# EAGLE design 04_ControllerStage_v1 (EAGLE 9.6.2)

## Sheet 1 of 2
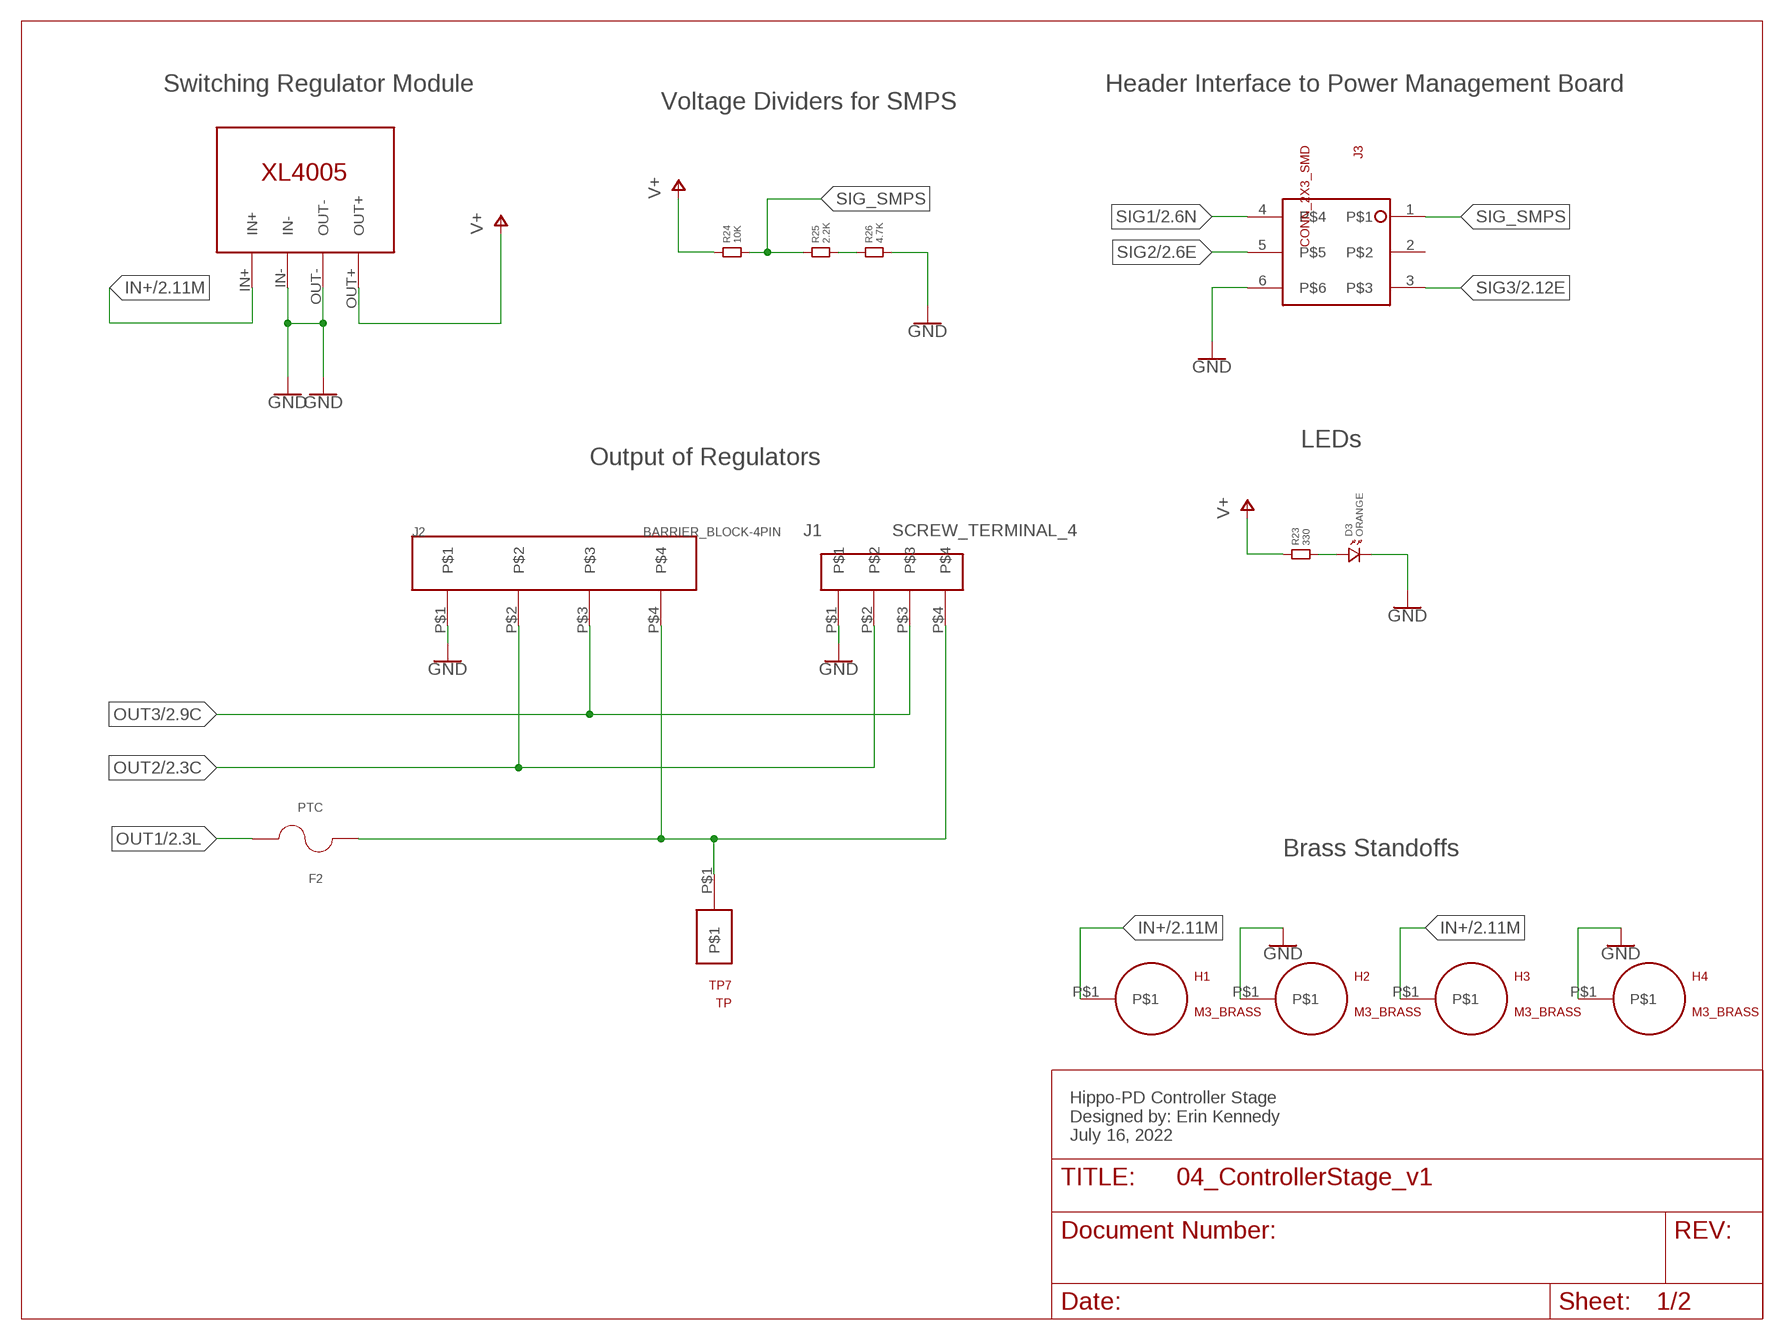
[diagram p0: schematic, sheet 1]

### Parts
D3  ORANGE  LED.1206  [1206.LED]
F2  PTC  [PTC]
H1  M3_BRASS  [M3_BRASS]
H2  M3_BRASS  [M3_BRASS]
H3  M3_BRASS  [M3_BRASS]
H4  M3_BRASS  [M3_BRASS]
J1  SCREW_TERMINAL_4  [SCREW_TERM_4]
J2  BARRIER_BLOCK-4PIN  [BARRIERBLOCK-4PIN]
J3  CONN_2X3_SMD  [2X3_SMD_CONNECTOR]
R23  330  RESISTOR.1206  [1206]
R24  10K  RESISTOR.1206  [1206]
R25  2.2K  RESISTOR.1206  [1206]
R26  4.7K  RESISTOR.1206  [1206]
TP7  TP  [TP]
U1  XL4005-DEV  [XL4005-DEV]

### Nets
GND: D3.P$2 H2.P$1 H4.P$1 J1.P$1 J2.P$1 J3.6 R26.2 U1.IN- U1.OUT- ; also sheet 2
IN+: H1.P$1 H3.P$1 U1.IN+ ; also sheet 2
N$7: D3.P$1 R23.2
N$9: R25.2 R26.1
N$18: F2.1 J1.P$4 J2.P$4 TP7.P$1
OUT1: F2.2 ; also sheet 2
OUT2: J1.P$2 J2.P$2 ; also sheet 2
OUT3: J1.P$3 J2.P$3 ; also sheet 2
SIG1: J3.4 ; also sheet 2
SIG2: J3.5 ; also sheet 2
SIG3: J3.3 ; also sheet 2
SIG_SMPS: J3.1 R24.2 R25.1
V+: R23.1 R24.1 U1.OUT+ ; also sheet 2
Unconnected: J3.2

### Notes on the sheet
- Switching Regulator Module | Header Interface to Power Management Board
- Voltage Dividers for SMPS
- LEDs
- Output of Regulators
- Brass Standoffs
- Hippo-PD Controller Stage
  Designed by: Erin Kennedy
  July 16, 2022

## Sheet 2 of 2
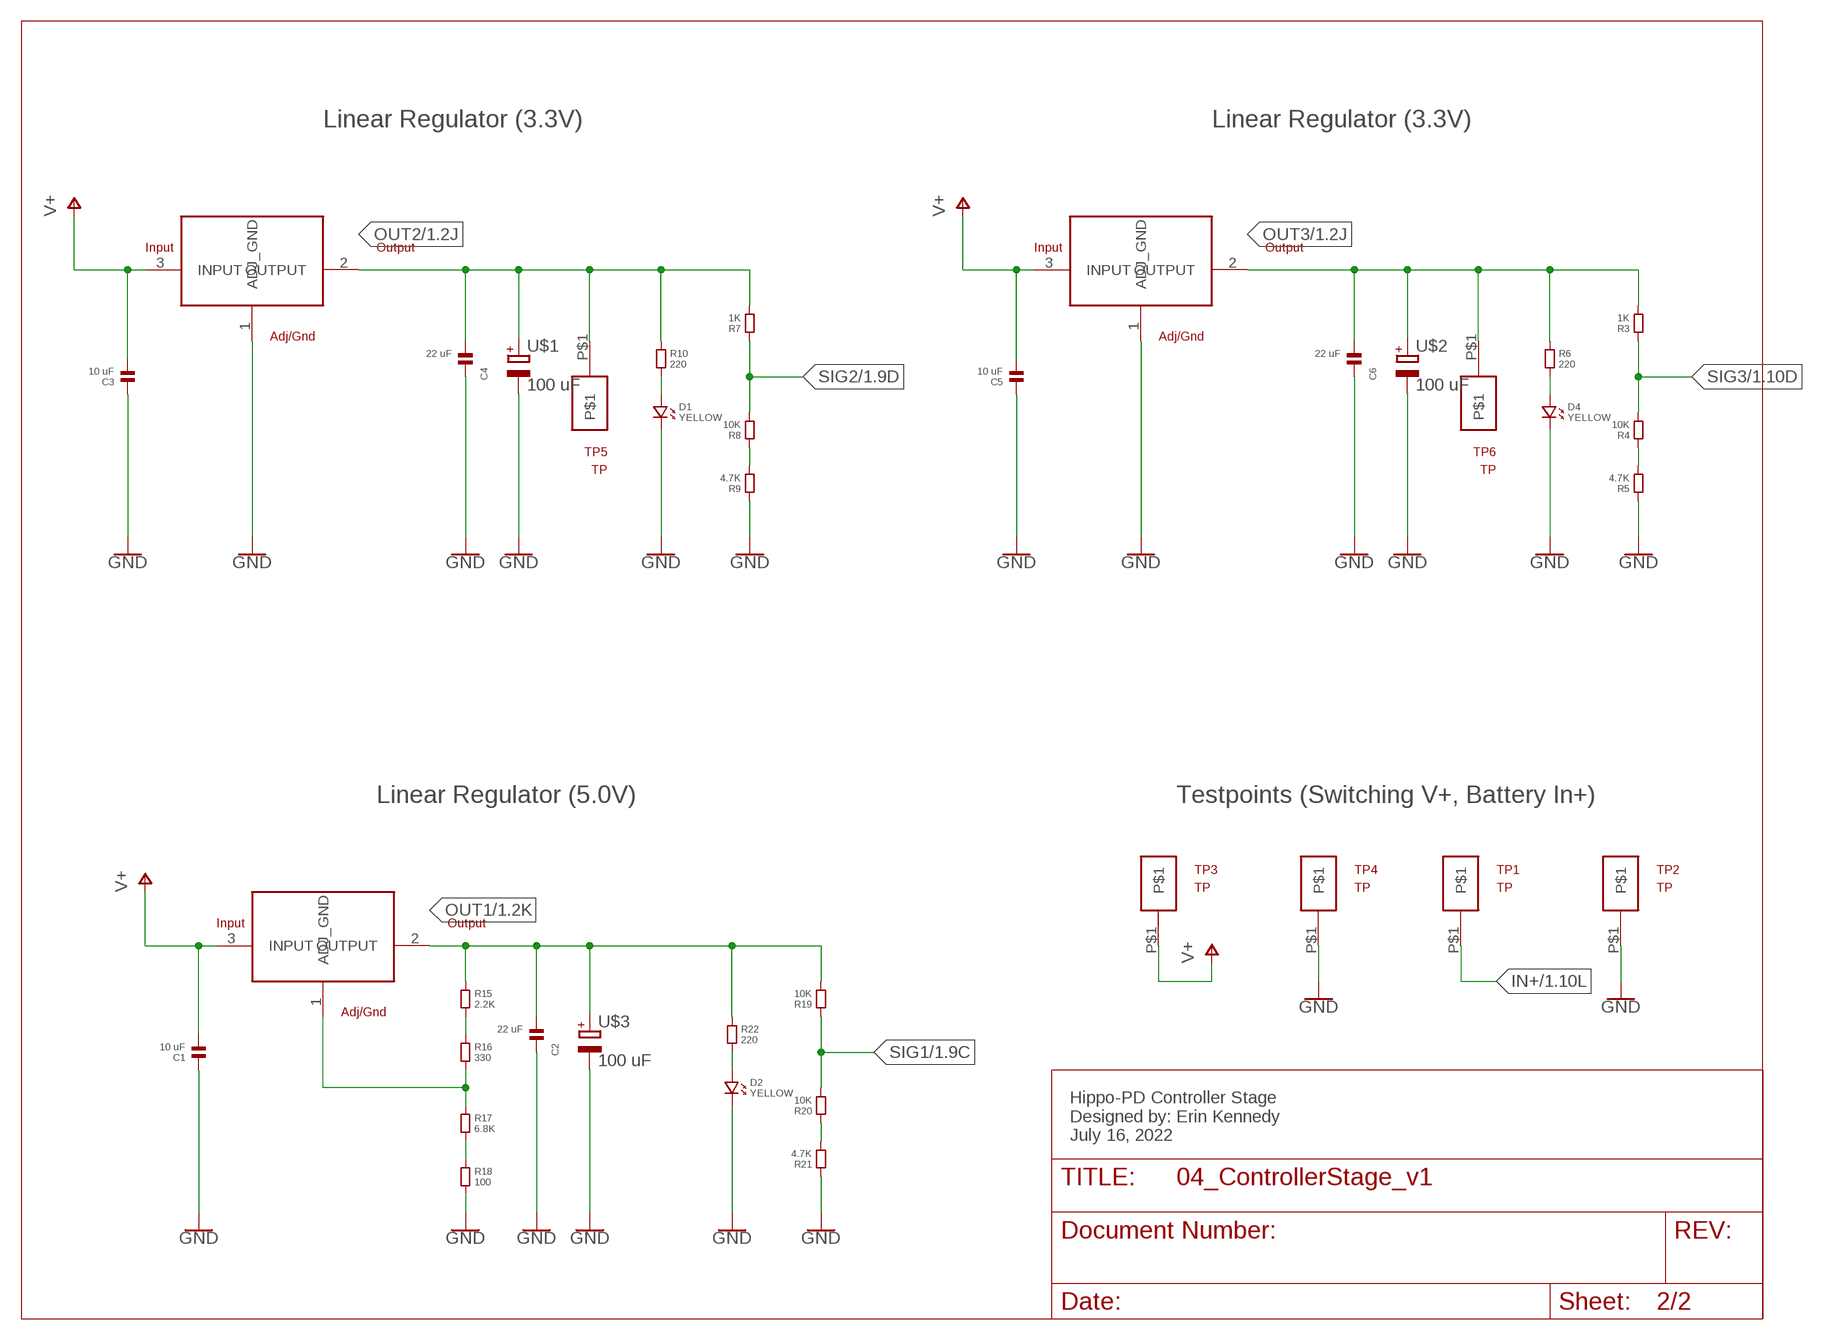
[diagram p1: schematic, sheet 2]

### Parts
C1  10 uF  CAPACITOR.1206  [1206]
C2  22 uF  CAPACITOR.1206  [1206]
C3  10 uF  CAPACITOR.1206  [1206]
C4  22 uF  CAPACITOR.1206  [1206]
C5  10 uF  CAPACITOR.1206  [1206]
C6  22 uF  CAPACITOR.1206  [1206]
D1  YELLOW  LED.1206  [1206.LED]
D2  YELLOW  LED.1206  [1206.LED]
D4  YELLOW  LED.1206  [1206.LED]
R1  AZ1117CDAZ1117CD  [AZ1117CD]
R2  AZ1117CDAZ1117CD  [AZ1117CD]
R3  1K  RESISTOR.1206  [1206]
R4  10K  RESISTOR.1206  [1206]
R5  4.7K  RESISTOR.1206  [1206]
R6  220  RESISTOR.1206  [1206]
R7  1K  RESISTOR.1206  [1206]
R8  10K  RESISTOR.1206  [1206]
R9  4.7K  RESISTOR.1206  [1206]
R10  220  RESISTOR.1206  [1206]
R14  AZ1084C  [AZ1084C]
R15  2.2K  RESISTOR.1206  [1206]
R16  330  RESISTOR.1206  [1206]
R17  6.8K  RESISTOR.1206  [1206]
R18  100  RESISTOR.1206  [1206]
R19  10K  RESISTOR.1206  [1206]
R20  10K  RESISTOR.1206  [1206]
R21  4.7K  RESISTOR.1206  [1206]
R22  220  RESISTOR.1206  [1206]
TP1  TP  [TP]
TP2  TP  [TP]
TP3  TP  [TP]
TP4  TP  [TP]
TP5  TP  [TP]
TP6  TP  [TP]
U$1  100 uF  ELECTROLYTIC_CAP  [ELECTROLYTIC_CAP]
U$2  100 uF  ELECTROLYTIC_CAP  [ELECTROLYTIC_CAP]
U$3  100 uF  ELECTROLYTIC_CAP  [ELECTROLYTIC_CAP]

### Nets
GND: C1.1 C2.1 C3.1 C4.1 C5.1 C6.1 D1.P$2 D2.P$2 D4.P$2 R1.1(ADJ_GND) R2.1(ADJ_GND) R5.1 R9.1 R18.2 R21.1 TP2.P$1 TP4.P$1 U$1.- U$2.- U$3.- ; also sheet 1
IN+: TP1.P$1 ; also sheet 1
N$1: D1.P$1 R10.2
N$2: D4.P$1 R6.2
N$3: R4.1 R5.2
N$5: R8.1 R9.2
N$10: D2.P$1 R22.2
N$11: R15.2 R16.1
N$12: R14.1(ADJ_GND) R16.2 R17.1
N$13: R17.2 R18.1
N$14: R20.1 R21.2
OUT1: C2.2 R14.2(OUTPUT) R15.1 R19.2 R22.1 U$3.+ ; also sheet 1
OUT2: C4.2 R1.2(OUTPUT) R7.2 R10.1 TP5.P$1 U$1.+ ; also sheet 1
OUT3: C6.2 R2.2(OUTPUT) R3.2 R6.1 TP6.P$1 U$2.+ ; also sheet 1
SIG1: R19.1 R20.2 ; also sheet 1
SIG2: R7.1 R8.2 ; also sheet 1
SIG3: R3.1 R4.2 ; also sheet 1
V+: C1.2 C3.2 C5.2 R1.3(INPUT) R2.3(INPUT) R14.3(INPUT) TP3.P$1 ; also sheet 1

### Notes on the sheet
- Linear Regulator (3.3V) | Linear Regulator (3.3V)
- Linear Regulator (5.0V) | Testpoints (Switching V+, Battery In+)
- Hippo-PD Controller Stage
  Designed by: Erin Kennedy
  July 16, 2022

## Library data of the parts
C1-C6 = standardparts:CAPACITOR
D1-D4 = standardparts:LED
F2 = Hippo-PS:PTC: PTC Resettable Fuse 0.75A(hold) 1.5A(trip) 60VDC 40A 1.5W 0.3s 0.18Ohm SMD Solder Pad 7.98 X 5.44 X 1.15mm T/R Check availability <https://pricing.snapeda.com/parts/0ZCF0075AF2C/Bel%20Fuse/view-part?ref=eda>; AVAILABILITY: In Stock; DESCRIPTION: 2920 SMT PPTC | 0.75 Ih | 603V; MF: Bel Fuse; MP: 0ZCF0075AF2C; PACKAGE: 2920 Bel Fuse; PRICE: None; PURCHASE-URL: https://pricing.snapeda.com/search/part/0ZCF0075AF2C/?ref=eda
H1-H4 = Hippo-PS:M3_BRASS
J1 = EK's Parts:SCREW_TERMINAL_4
J2 = Hippo-PS:BARRIER_BLOCK-4PIN: Barrier block connector Digikey #ED2946-ND
J3 = Hippo-PS:CONN_2X3_SMD
R1 R2 = Hippo-PS:AZ1117CD
R3-R10 R15-R26 = standardparts:RESISTOR
R14 = Hippo-PS:AZ1084C
TP1-TP7 = Hippo-PS:TP
U1 = Hippo-PS:XL4005-DEV
U$1-U$3 = Hippo-PS:ELECTROLYTIC_CAP: Check availability <https://pricing.snapeda.com/parts/865080545012/Wurth%20Electronics/view-part?ref=eda>; AVAILABILITY: In Stock; DESCRIPTION: 100 µF 35 V Aluminum Electrolytic Capacitors Radial, Can - SMD - 2000 Hrs @ 105°C; MF: Wurth Electronics; MP: 865080545012; PACKAGE: Radial Würth Elektronik; PRICE: None; PURCHASE-URL: https://pricing.snapeda.com/search/part/865080545012/?ref=eda

## Board
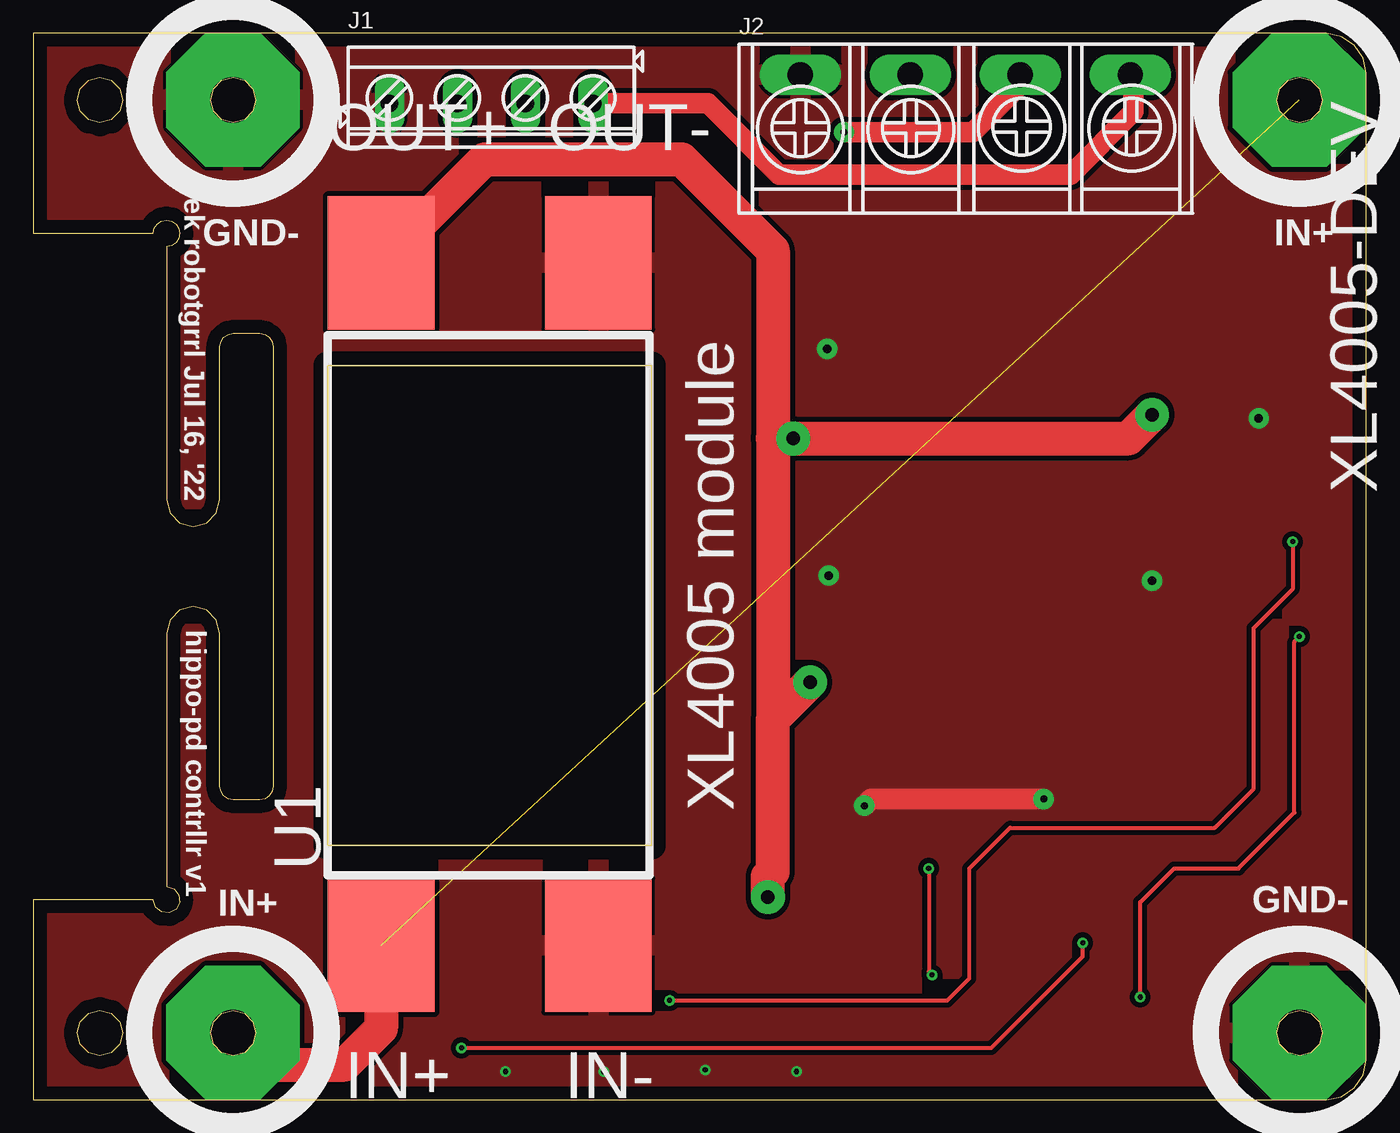
[diagram p2: board, top side]
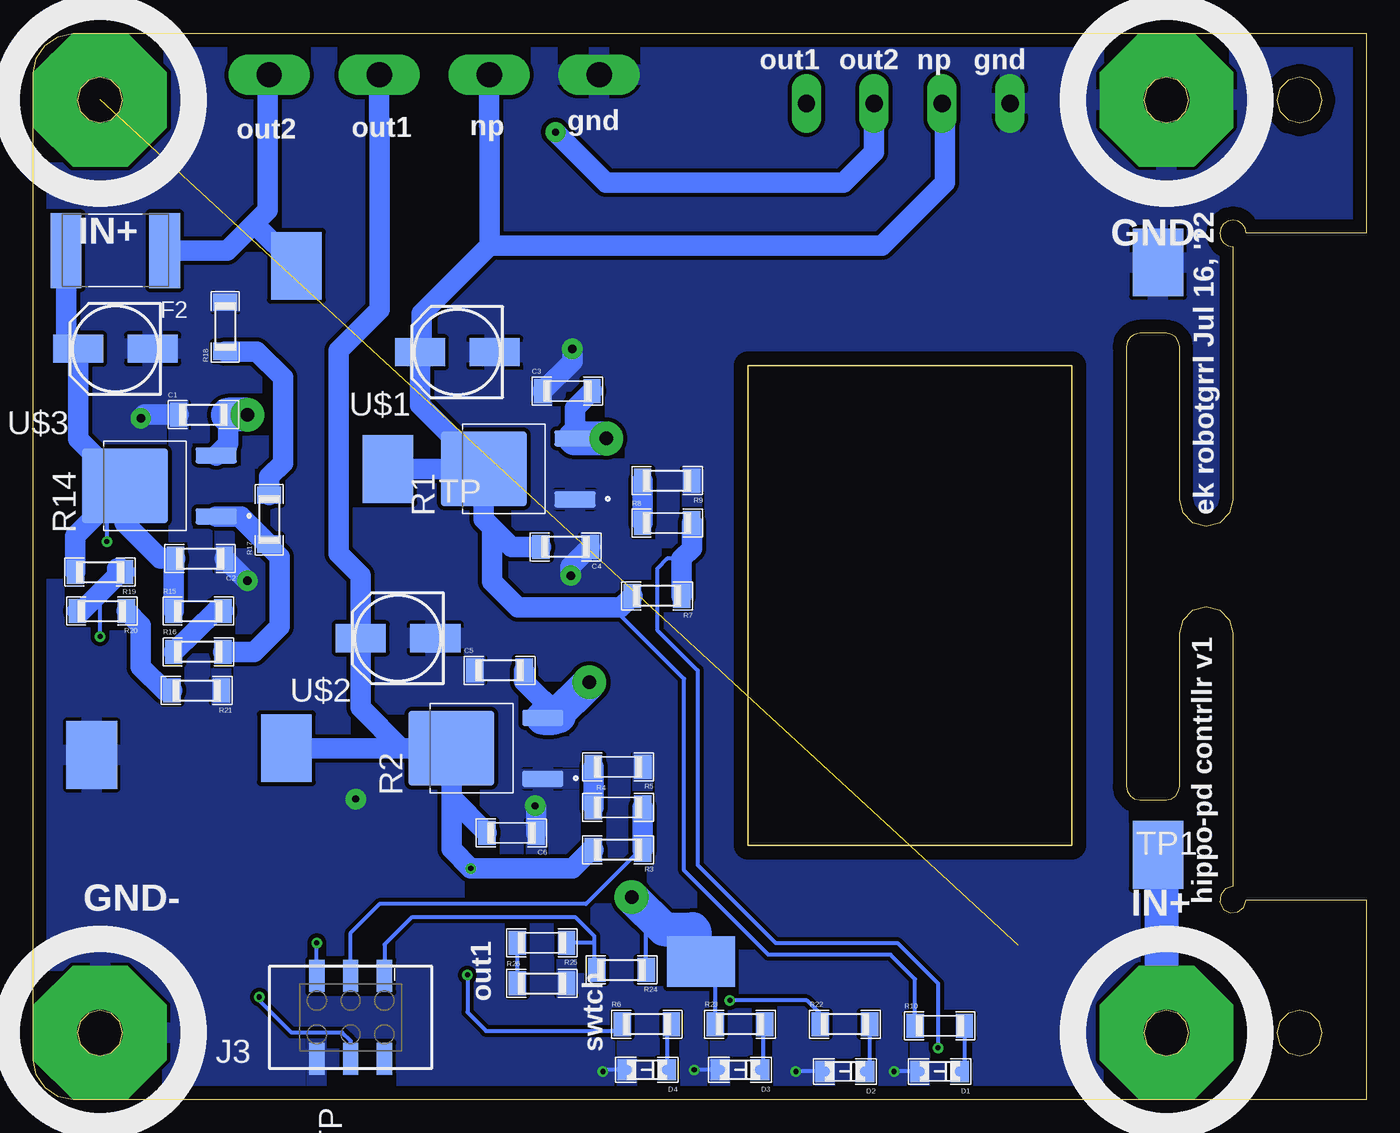
[diagram p3: board, bottom side, seen from below]

Size 100 x 80 mm. Coordinates in mm from the lower left corner, seen from the top.
Outline: 100,77 99.77,78.15 99.12,79.12 98.15,79.77 97,80 0,80 0,65 9,65 9.08,65.39 9.29,65.71 9.61,65.92 10,66 10.39,65.92 10.71,65.71 10.92,65.39 11,65 10.92,64.61 10.71,64.29 10.39,64.08 10,64 10,45 10.27,44 11,43.27 12,43 13,43.27 13.73,44 14,45 14,56.5 14.08,56.89 14.29,57.21 14.61,57.42 15,57.5 17,57.5 17.39,57.42 17.71,57.21 17.92,56.89 18,56.5 18,23.5 17.92,23.11 17.71,22.79 17.39,22.58 17,22.5 15,22.5 14.61,22.58 14.29,22.79 14.08,23.11 14,23.5 14,35 13.73,36 13,36.73 12,37 11,36.73 10.27,36 10,35 10,16 10.56,15.83 10.92,15.38 10.98,14.8 10.71,14.29 10.2,14.02 9.62,14.08 9.17,14.44 9,15 0,15 0,0 97,0 98.15,0.23 99.12,0.88 99.77,1.85 100,3 100,77
Outline: 6.7,75 6.47,74.15 5.85,73.53 5,73.3 4.15,73.53 3.53,74.15 3.3,75 3.53,75.85 4.15,76.47 5,76.7 5.85,76.47 6.47,75.85 6.7,75
Outline: 96.7,75 96.47,74.15 95.85,73.53 95,73.3 94.15,73.53 93.53,74.15 93.3,75 93.53,75.85 94.15,76.47 95,76.7 95.85,76.47 96.47,75.85 96.7,75
Outline: 96.7,5 96.47,4.15 95.85,3.53 95,3.3 94.15,3.53 93.53,4.15 93.3,5 93.53,5.85 94.15,6.47 95,6.7 95.85,6.47 96.47,5.85 96.7,5
Outline: 16.7,75 16.47,74.15 15.85,73.53 15,73.3 14.15,73.53 13.53,74.15 13.3,75 13.53,75.85 14.15,76.47 15,76.7 15.85,76.47 16.47,75.85 16.7,75
Outline: 16.7,5 16.47,4.15 15.85,3.53 15,3.3 14.15,3.53 13.53,4.15 13.3,5 13.53,5.85 14.15,6.47 15,6.7 15.85,6.47 16.47,5.85 16.7,5
Outline: 6.7,5 6.47,4.15 5.85,3.53 5,3.3 4.15,3.53 3.53,4.15 3.3,5 3.53,5.85 4.15,6.47 5,6.7 5.85,6.47 6.47,5.85 6.7,5
Copper layers (1*16): Top 0.035mm / dielectric 1.5mm / Bottom 0.035mm
Design rules "default *": minimum track width 8mil, minimum drill 15mil, track to track 10mil, track to pad 10mil, pad to pad 10mil, via to via 10mil, smd to smd 10mil, copper to edge 40mil, drill to drill 10mil, minimum pad ring 10mil, minimum via ring 8mil, stop-mask expansion 4mil, vias tented up to drill 0mil, thermal gap 10mil

### Footprints (pad centres in the part's own frame; a part is rotated, then mirrored left to right if it is on the bottom)
1206 = smd 1.3 x 1.8: 1 -1.85,0; 2 1.85,0
1206.LED = smd 1.4 x 1.6: P$1 -1.5,0; P$2 1.5,0
PTC = smd 2.3 x 5.6: 1 -3.7,0; 2 3.7,0
M3_BRASS = drill 3.4 pad 10 octagon: P$1 0,0
SCREW_TERM_4 = drill 1.3 pad 2.2 long: P$1 3.1,3.3; P$2 8.2,3.3; P$3 13.3,3.3; P$4 18.38,3.3
BARRIERBLOCK-4PIN = drill 1.905 pad 3.048 long: P$1 4.6,10.4; P$2 12.85,10.4; P$3 21.1,10.4; P$4 29.355,10.4
2X3_SMD_CONNECTOR = smd 1.147 x 2.408: 1 -2.54,-3.104; 2 -2.54,3.104; 3 0,-3.104; 4 0,3.104; 5 2.54,-3.104; 6 2.54,3.104
AZ1117CD = smd 1.204 x 3.098: 1 -2.286,-4.26; 3 2.286,-4.26 | smd 5.63 x 6.448: 2 0,2.59
AZ1084C = smd 1.204 x 3.098: 1 -2.286,-4.26; 3 2.286,-4.26 | smd 5.63 x 6.448: 2 0,2.59
TP = smd 3.81 x 5.08: P$1 0,0
XL4005-DEV = smd 8 x 10: IN+ 4,-5; IN- 20.3,-5; OUT+ 4,46.2; OUT- 20.3,46.2
ELECTROLYTIC_CAP = smd 3.754 x 2.108: + 2.8,0; - -2.8,0

### Placement (x,y rotation side)
C1  87.24,51.39 0 bottom
C2  87.5,40.59 180 bottom
C3  59.94,53.17 0 bottom
C4  60.06,41.48 180 bottom
C5  65.02,32.21 0 bottom
C6  64.13,20.02 180 bottom
D1  32,2.11 180 bottom
D2  39.11,2.11 180 bottom
D3  46.98,2.24 180 bottom
D4  53.97,2.24 180 bottom
F2  93.85,63.71 180 bottom
H1  14.98,5.03 0 top
H2  94.99,5.03 0 top
H3  94.99,75.01 0 top
H4  14.98,75.01 0 top
J1  23.61,71.45 0 top
J2  52.95,66.5 0 top
J3  76.19,6.18 180 bottom
R1  63.62,47.32 90 bottom
R2  66.03,26.37 90 bottom
R3  56.13,18.75 180 bottom
R4  56.13,21.92 0 bottom
R5  56.13,24.97 180 bottom
R6  53.97,5.67 0 bottom
R7  53.21,37.8 180 bottom
R8  52.44,43.26 0 bottom
R9  52.44,46.43 180 bottom
R10  32,5.54 0 bottom
R14  90.54,46.05 90 bottom
R15  87.62,36.66 0 bottom
R16  87.62,33.61 0 bottom
R17  82.29,43.51 90 bottom
R18  85.59,57.99 90 bottom
R19  94.99,39.58 180 bottom
R20  94.86,36.66 180 bottom
R21  87.75,30.69 180 bottom
R22  39.11,5.67 0 bottom
R23  46.98,5.67 0 bottom
R24  55.87,9.73 180 bottom
R25  61.84,11.76 180 bottom
R26  61.84,8.72 0 bottom
TP1  15.61,18.37 0 bottom
TP2  15.61,62.82 0 bottom
TP3  49.9,10.37 270 bottom
TP4  95.62,25.86 180 bottom
TP5  73.4,47.32 0 bottom
TP6  81.02,26.37 0 bottom
TP7  80.26,62.56 0 bottom
U1  22.09,16.59 0 top
U$1  68.19,56.09 180 bottom
U$2  72.64,34.62 180 bottom
U$3  93.85,56.34 180 bottom

### Tracks (layer width: path | path; a pad name or v marks a point on that pad's centre or on a via)
GND  (via drill 0.38 pad 0.64, 0.51 pad 1.52, 0.64 pad 1.52)
  Top 1.524: v75.81,22.56 62.86,22.56 v62.35,22.05
  Bottom 0.305: D1.P$2 v35.43,2.11 | D2.P$2 v42.79,2.11 | D3.P$2 v50.41,2.24 | D4.P$2 57.14,2.24 v57.27,2.11
  Bottom 1.524: C6.1 62.28,21.98 v62.35,22.05 | C1.1 91.69,51.39 v91.94,51.13 | C3.1 59.56,55.4 v59.56,56.34 | C4.1 59.68,40.01 v59.68,39.32 | C2.1 83.99,38.94 v83.94,38.94
  pour Bottom (isolate 0.305): -4.58,85.93 -4.58,-5.51 107.18,-5.51 107.18,85.93
  pour Top (isolate 0.381): -4.58,87.84 -4.58,-5.51 107.18,-5.51 107.18,87.84
IN+  (1 unrouted)
  Top 2.54: H1.P$1 17.39,2.62 23.36,2.62 26.09,5.35 U1.IN+ 25.71,11.21
  Bottom 2.54: TP1.P$1 15.36,18.11 15.36,5.41 H1.P$1
N$1
  Bottom 0.305: R10.2 30.15,2.46 D1.P$1
N$2
  Bottom 0.305: R6.2 52.47,5.32 D4.P$1
N$3
  Bottom 1.524: R4.1 R5.2
N$5
  Bottom 1.524: R8.1 R9.2
N$7
  Bottom 0.305: R23.2 45.26,5.54 45.26,2.46 D3.P$1
N$9
  Bottom 0.305: R25.2 R26.1
N$10
  Bottom 0.305: R22.2 37.26,2.46 D2.P$1
N$11
  Bottom 1.524: R15.2 86.33,36.66 R16.1
N$12
  Bottom 1.524: R16.2 83.43,33.61 81.53,35.51 81.53,40.72 84.57,43.77 R14.1 84.39,43.77 R17.1
N$13
  Bottom 1.524: R17.2 82.29,46.76 81.27,47.78 81.27,54.18 83.23,56.14 R18.1
N$14
  Bottom 1.524: R20.1 91.94,35.58 91.94,32.46 90.16,30.69 R21.2
N$18
  Top 1.524: J2.P$4 82.54,76.66 82.54,74.12 77.84,69.42 55.96,69.42 50.63,74.75 J1.P$4
  Bottom 1.524: F2.1 85.46,63.71 83.43,65.74 | 83.43,65.74 82.42,66.75 82.42,76.79 J2.P$4 | TP7.P$1 83.43,65.74
OUT1  (via drill 0.38 pad 0.64)
  Top 0.305: v94.48,41.86 94.48,38.31 91.56,35.39 91.56,23.32 88.64,20.4 73.27,20.4 70.22,17.35 70.22,9.1 68.57,7.45 v47.74,7.45
  Bottom 0.305: R14.2 94.48,44.71 v94.48,41.86 | R22.1 40.96,6.43 41.97,7.45 v47.74,7.45
  Bottom 1.524: R14.2 96.65,49.57 U$3.+ 97.55,57.24 F2.2 | R14.2 93.13,43.26 90.47,40.59 C2.2 89.47,40.47 R15.1 | R19.2 96.84,42.3 93.13,46 R14.2
OUT2
  Bottom 0.305: R10.1 33.85,9.04 35.68,10.87 44.85,10.87 51.17,17.2 51.17,31.58 55.94,36.35 55.94,36.91
  Bottom 1.524: R1.2 70.99,52.11 U$1.+ 70.88,56.2 70.88,58.99 65.78,64.09 | 65.78,64.09 65.78,73.1 65.8,73.13 J2.P$2 | 65.78,64.09 36.31,64.09 31.62,68.79 31.62,74.55 J1.P$2 | R1.2 TP5.P$1 | R1.2 66.21,43.56 65.57,42.93 | C4.2 64.13,41.48 65.57,42.93 | 65.57,42.93 65.57,38.86 63.62,36.91 55.94,36.91 R7.2
OUT3  (via drill 0.38 pad 0.64, 0.51 pad 1.52)
  Top 0.305: v67.43,9.35 67.18,9.6 v67.18,17.35
  Top 1.524: J2.P$3 74.05,76.17 70.48,72.6 v60.83,72.6
  Bottom 0.305: R6.1 56.33,5.16 66.03,5.16 67.43,6.56 v67.43,9.35
  Bottom 1.524: J2.P$3 74.05,73.5 74.03,73.49 74.03,59.26 77.08,56.21 77.08,40.97 75.44,39.33 U$2.+ 75.44,29.42 72.39,26.37 R2.2 | v60.83,72.6 57.02,68.79 39.24,68.79 36.91,71.11 J1.P$3 | R2.2 TP6.P$1 | R2.2 68.62,22.66 C6.2 | R2.2 68.62,18.8 v67.18,17.35 59.56,17.35 58.16,18.75 R3.2
SIG1  (via drill 0.38 pad 0.64)
  Top 0.305: v83.05,7.7 83.05,14.81 85.59,17.35 90.42,17.35 94.61,21.54 94.61,34.37 v94.99,34.75
  Bottom 0.305: J3.4 76.19,4.4 76.83,5.03 80.64,5.03 83.05,7.45 v83.05,7.7 | v94.99,34.75 94.99,38.05 94.92,38.12
  Bottom 1.524: R19.1 93.42,39.86 93.72,39.86 93.72,39.32 94.92,38.12 96.39,36.66 R20.2
SIG2  (via drill 0.38 pad 0.64)
  Top 0.305: v32.12,3.89 71.87,3.89 78.73,10.75 v78.73,11.76
  Bottom 0.305: v32.12,3.89 32.12,8.72 35.17,11.76 44.32,11.76 50.16,17.61 50.16,32.21 53.21,35.26 53.21,39.83 52.44,40.59 51.36,40.59 | J3.5 v78.73,11.76
  Bottom 1.524: R8.2 50.59,41.35 51.36,40.59 R7.1
SIG3
  Bottom 0.305: R3.1 54.48,18.75 58.54,14.68 74.03,14.68 76.19,12.53 J3.3
  Bottom 1.524: R4.2 R3.1
SIG_SMPS
  Bottom 0.305: R24.2 57.9,9.73 57.9,11.76 | 57.9,11.76 R25.1 | 57.9,11.76 57.9,12.27 59.3,13.67 71.62,13.67 73.65,11.64 J3.1
V+  (via drill 1.02 pad 2.54)
  Top 2.54: U1.OUT+ 33.87,70.56 48.63,70.56 55.49,63.71 55.49,49.61 | 55.49,49.61 55.49,28.53 | v55.11,15.19 55.11,16.72 55.49,17.1 55.49,28.53 | 55.49,28.53 v58.29,31.32 | 55.49,49.61 v57.02,49.61 82.16,49.61 v83.94,51.39
  Bottom 0.305: R24.1 54.02,14.1 v55.11,15.19 | R23.1 48.83,10.95 50.41,12.53 | 50.41,12.65 50.54,12.78
  Bottom 1.524: R14.3 85.39,49.23 C1.2 | C5.2 63.17,31.38 60.57,28.78 | R1.3 59.36,51.89 C3.2
  Bottom 2.54: TP3.P$1 50.41,10.37 50.41,12.53 50.41,12.65 | v55.11,15.19 52.7,12.78 50.54,12.78 | 60.57,28.78 61.65,28.78 R2.3 60.95,28.65 v58.29,31.32 | v57.02,49.61 R1.3 | v83.94,51.39 C1.2

### Text on the board
tPlace: ek robotgrrl Jul 16, '22 | GND- | IN+ | hippo-pd contrllr v1 | IN+ | GND-
bPlace: gnd | np | out2 | out1 | gnd | np | out1 | out2 | GND- | IN+ | ek robotgrrl Jul 16, '22 | + | hippo-pd contrllr v1 | IN+ | GND- | out1 | swtch
tNames: word